# Altium project Drofnats.PrjPcb
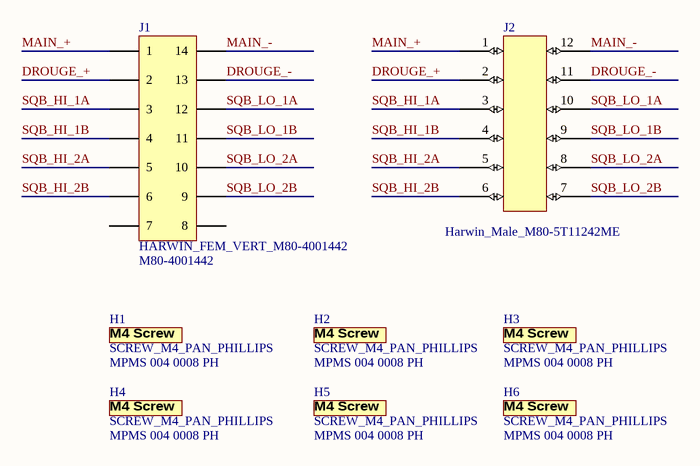
[diagram p0: Drofnats.SchDoc]
1 sheet, 8 parts. Net scope: global (net labels, ports and power ports of the same name join across sheets).
Board file: Drofnats.PcbDoc

## Sheet Drofnats.SchDoc
size A; SheetNumber: 1; SheetTotal: 1

### Parts
H1  SCREW_M4_PAN_PHILLIPS  Manufacturer Part Number: MPMS 004 0008 PH  [SCREW_M4]
H2  SCREW_M4_PAN_PHILLIPS  Manufacturer Part Number: MPMS 004 0008 PH  [SCREW_M4]
H3  SCREW_M4_PAN_PHILLIPS  Manufacturer Part Number: MPMS 004 0008 PH  [SCREW_M4]
H4  SCREW_M4_PAN_PHILLIPS  Manufacturer Part Number: MPMS 004 0008 PH  [SCREW_M4]
H5  SCREW_M4_PAN_PHILLIPS  Manufacturer Part Number: MPMS 004 0008 PH  [SCREW_M4]
H6  SCREW_M4_PAN_PHILLIPS  Manufacturer Part Number: MPMS 004 0008 PH  [SCREW_M4]
J1  HARWIN_FEM_VERT_M80-4001442  Manufacturer Part Number: M80-4001442  [HARWIN_M80-4001442]
J2  Harwin M80-5T11242ME  [HARWIN-M80-5T11242ME]  (value not drawn)

### Nets
DROUGE_+: J1.2 J2.2
DROUGE_-: J1.13 J2.11
MAIN_+: J1.1 J2.1
MAIN_-: J1.14 J2.12
SQB_HI_1A: J1.3 J2.3
SQB_HI_1B: J1.4 J2.4
SQB_HI_2A: J1.5 J2.5
SQB_HI_2B: J1.6 J2.6
SQB_LO_1A: J1.12 J2.10
SQB_LO_1B: J1.11 J2.9
SQB_LO_2A: J1.10 J2.8
SQB_LO_2B: J1.9 J2.7

Not connected (* = marked no-connect by the designer): J1 7 8

### Notes on the sheet
- (in symbol CMP-00034-5) Harwin_Male_M80-5T11242ME
- (in symbol CMP-054-0009-1) M4 Screw

### Library data of the parts
H1-H6 = CMP-054-0009-1: MACHINE SCREW PAN PHILLIPS M4; Manufacturer: B&F Fastener Supply; Head Diameter: 0.308" (7.82mm); Screw Head Type: Pan Head; Head Height: 0.120" (3.05mm); Plating: Zinc; Length - Below Head: 0.315" (8.00mm); Features: -; Length - Overall: 0.435" (11.05mm); ComponentLink1Description: Datasheet; Source: mechanical.SchLib; ComponentLink1URL: http://www.fasnetdirect.com/refguide/MetD7985a.pdf; Drive Type: Phillips; Material: -; Thread Size: M4; Pricing 1: 100=0.0756, 1000=0.06048 (USD); Design Item ID: SCREW_M4_PAN_PHILLIPS; RoHS: RoHS non-compliant; Stock 1: 2800
J1 = CMP-030-0080-1: 7+7 POS FEM +J/S 3mm TAIL TIN; Manufacturer: Harwin; Number of Positions Loaded: All; Row Spacing: 0.079" (2.00mm); Number of Positions: 14; Connector Type: Receptacle; ComponentLink1Description: https://datasheet.ciiva.com/8051/10217-8051606.pdf; Termination: Solder; ComponentLink2URL: https://datasheet.ciiva.com/11749/0900766b80da66b3-11749902.pdf; ComponentLink2Description: https://datasheet.ciiva.com/11749/0900766b80da66b3-11749902.pdf; Design Item ID: HARWIN_FEM_VERT_M80-4001442; Color: Black; Number of Rows: 2; Mounting Type: Through Hole; Series: Datamate J-Tek; ComponentLink3URL: https://datasheet.ciiva.com/9480/m80-400-9480223.pdf; Features: Jackscrews; Contact Finish Thickness: 12µin (0.30µm); Stock 1: 66; Source: connector.SchLib; Family: Rectangular Connectors - Headers, Receptacles, Female Sockets; ComponentLink3Description: https://datasheet.ciiva.com/9480/m80-400-9480223.pdf; Packaging: Tube; Pitch: 0.079" (2.00mm); Contact Finish: Gold; Contact Type: Female Socket; Pricing 1: 1=12.82, 10=11.66, 50=10.49, 100=9.91, 1000=7.75, 10000=7.75 (USD); ComponentLink1URL: https://datasheet.ciiva.com/8051/10217-8051606.pdf; Fastening Type: -
J2 = CMP-00034-5: 6+6 Pos. Male DIL Vertical Throughboard Conn. 101Lok